# EAGLE design module_ram (EAGLE 5.09)
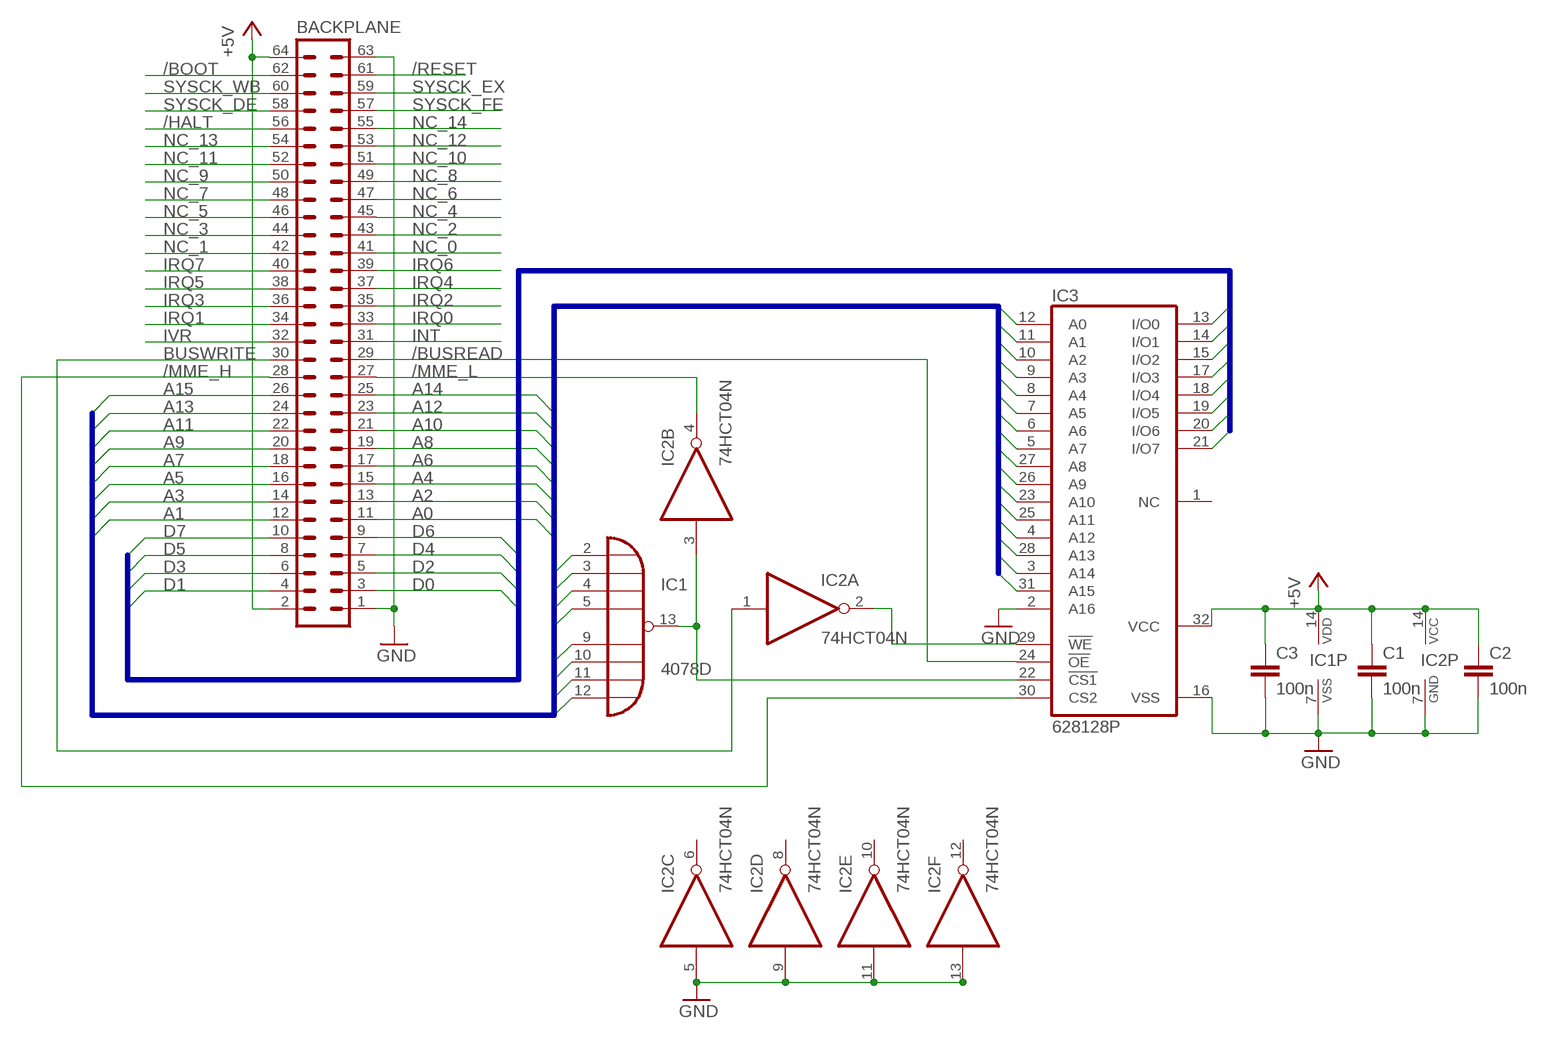
[diagram p0: schematic, sheet 1]

## Parts
BACKPLANE  ML64L  [ML64L]
C1  100n  C-EU025-024X044  [C025-024X044]
C2  100n  C-EU025-024X044  [C025-024X044]
C3  100n  C-EUC0805  [C0805]
IC1  4078D  [SO14]
IC2  74HCT04N  [DIL14]
IC3  628128P  [DIL32]

## Nets
+5V: BACKPLANE.2 BACKPLANE.64 C1.1 C2.1 C3.1 IC1.14(VDD) IC2.14(P:VCC) IC3.32(VCC)
/BOOT: BACKPLANE.62
/BUSREAD: BACKPLANE.29 IC3.24(!OE)
/HALT: BACKPLANE.56
/MME_H: BACKPLANE.28 IC3.30(CS2)
/MME_L: BACKPLANE.27 IC2.4(B:O)
/RESET: BACKPLANE.61
A0: BACKPLANE.11 IC1.2(I0) IC3.12(A0)
A1: BACKPLANE.12 IC1.3(I1) IC3.11(A1)
A2: BACKPLANE.13 IC1.4(I2) IC3.10(A2)
A3: BACKPLANE.14 IC1.5(I3) IC3.9(A3)
A4: BACKPLANE.15 IC1.9(I4) IC3.8(A4)
A5: BACKPLANE.16 IC1.10(I5) IC3.7(A5)
A6: BACKPLANE.17 IC1.11(I6) IC3.6(A6)
A7: BACKPLANE.18 IC1.12(I7) IC3.5(A7)
A8: BACKPLANE.19 IC3.27(A8)
A9: BACKPLANE.20 IC3.26(A9)
A10: BACKPLANE.21 IC3.23(A10)
A11: BACKPLANE.22 IC3.25(A11)
A12: BACKPLANE.23 IC3.4(A12)
A13: BACKPLANE.24 IC3.28(A13)
A14: BACKPLANE.25 IC3.3(A14)
A15: BACKPLANE.26 IC3.31(A15)
BUSWRITE: BACKPLANE.30 IC2.1(A:I)
D0: BACKPLANE.3 IC3.13(I/O0)
D1: BACKPLANE.4 IC3.14(I/O1)
D2: BACKPLANE.5 IC3.15(I/O2)
D3: BACKPLANE.6 IC3.17(I/O3)
D4: BACKPLANE.7 IC3.18(I/O4)
D5: BACKPLANE.8 IC3.19(I/O5)
D6: BACKPLANE.9 IC3.20(I/O6)
D7: BACKPLANE.10 IC3.21(I/O7)
GND: BACKPLANE.1 BACKPLANE.63 C1.2 C2.2 C3.2 IC1.7(VSS) IC2.5(C:I) IC2.7(P:GND) IC2.9(D:I) IC2.11(E:I) IC2.13(F:I) IC3.2(A16) IC3.16(VSS)
INT: BACKPLANE.31
IRQ0: BACKPLANE.33
IRQ1: BACKPLANE.34
IRQ2: BACKPLANE.35
IRQ3: BACKPLANE.36
IRQ4: BACKPLANE.37
IRQ5: BACKPLANE.38
IRQ6: BACKPLANE.39
IRQ7: BACKPLANE.40
IVR: BACKPLANE.32
N$1: IC2.2(A:O) IC3.29(!WE)
N$2: IC1.13(J) IC2.3(B:I) IC3.22(!CS1)
NC_0: BACKPLANE.41
NC_1: BACKPLANE.42
NC_2: BACKPLANE.43
NC_3: BACKPLANE.44
NC_4: BACKPLANE.45
NC_5: BACKPLANE.46
NC_6: BACKPLANE.47
NC_7: BACKPLANE.48
NC_8: BACKPLANE.49
NC_9: BACKPLANE.50
NC_10: BACKPLANE.51
NC_11: BACKPLANE.52
NC_12: BACKPLANE.53
NC_13: BACKPLANE.54
NC_14: BACKPLANE.55
SYSCK_DE: BACKPLANE.58
SYSCK_EX: BACKPLANE.59
SYSCK_FE: BACKPLANE.57
SYSCK_WB: BACKPLANE.60
Unconnected: IC2.6(C:O) IC2.8(D:O) IC2.10(E:O) IC2.12(F:O) IC3.1(NC)

## Buses
D[0..7]
A[0..15]

## Library data of the parts
BACKPLANE = con-ml:ML64L: HARTING
C1-C3 = rcl:C-EU: CAPACITOR, European symbol
IC1 = 40xx:4078: 8-input NOR
IC2 = 74xx-eu:74*04: Hex INVERTER
IC3 = memory-hitachi:628128P: MEMORY

## Net classes
0 Signal: width 0.254 mm, drill 0.508 mm, clearance 0.203 mm
1 LoVolt42: width 0.61 mm, drill 0.508 mm, clearance 0.813 mm to class 0, clearance 0.305 mm
2 MedVolt100: width 0.61 mm, drill 0.508 mm, clearance 1.626 mm to class 0, clearance 1.626 mm to class 1, clearance 0.813 mm
3 LineVolt350: width 0.813 mm, drill 0.508 mm, clearance 12.7 mm to class 0, clearance 12.7 mm to class 1, clearance 12.7 mm to class 2, clearance 2.54 mm

## Board
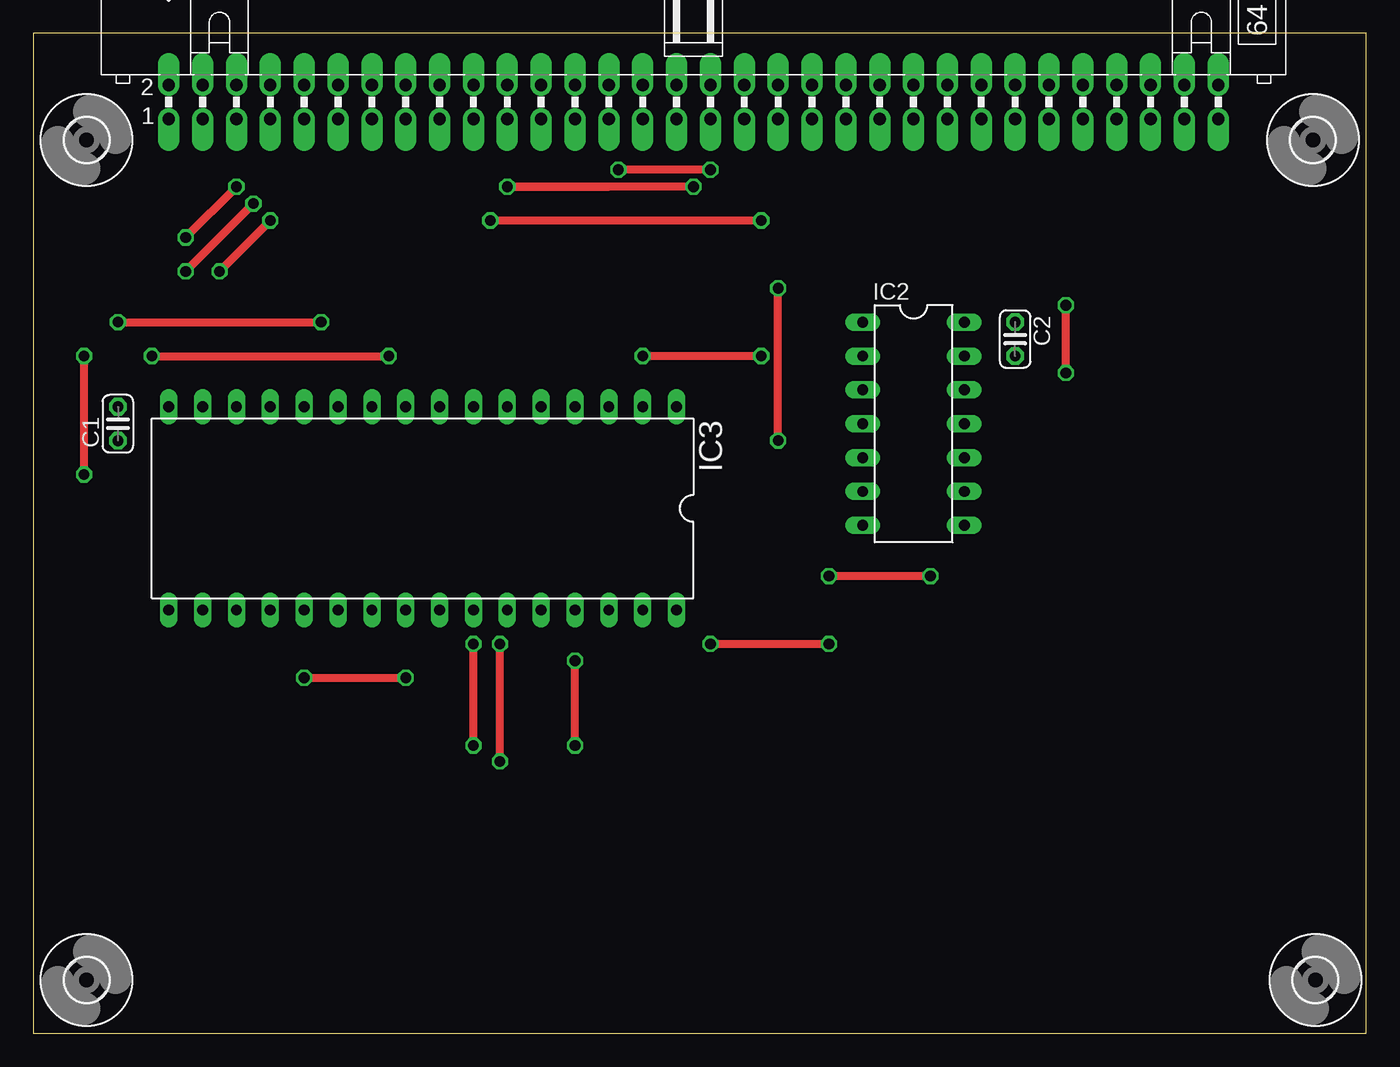
[diagram p1: board, top side]
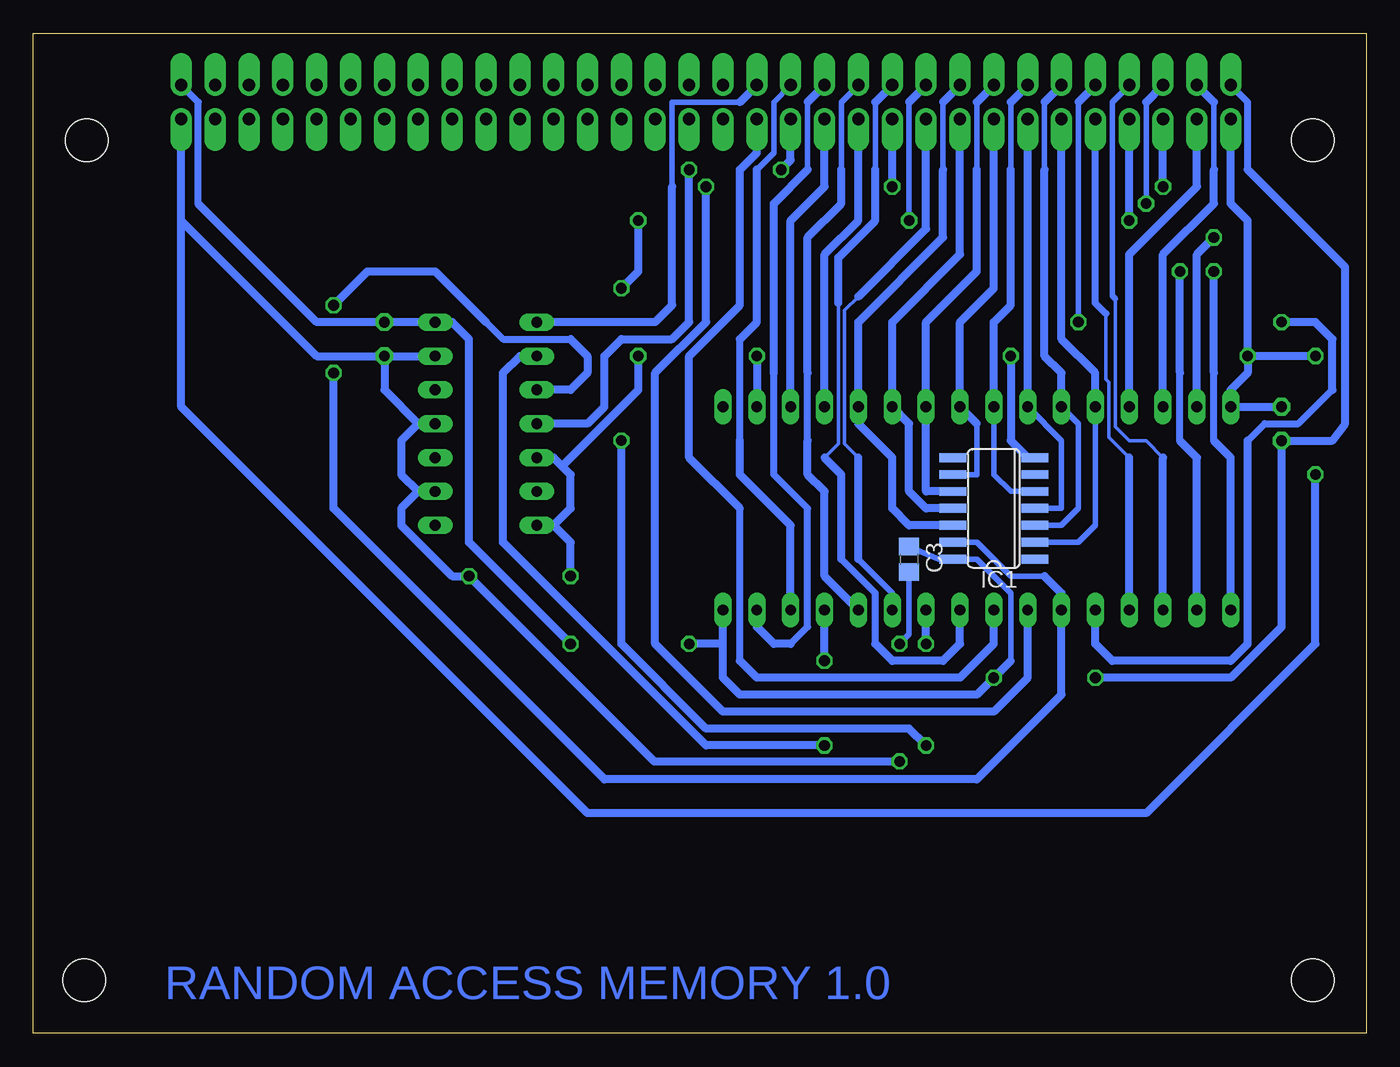
[diagram p2: board, bottom side, seen from below]

Size 100 x 75 mm. Coordinates in mm from the lower left corner, seen from the top.
Outline: 0,0 100,0 100,75 0,75 0,0
Copper layers (1*16): Top 0.035mm / dielectric 1.5mm / Bottom 0.035mm
Design rules "designrules": minimum track width 10mil, minimum drill 24mil, track to track 8mil, track to pad 8mil, pad to pad 8mil, via to via 8mil, smd to smd 8mil, copper to edge 40mil, drill to drill 8mil, minimum pad ring 10mil, minimum via ring 8mil, stop-mask expansion 4mil, vias tented up to drill 0mil, thermal gap 10mil

### Footprints (pad centres in the part's own frame; a part is rotated, then mirrored left to right if it is on the bottom)
ML64L = drill 0.914 pad 1.6 offset: 1 -39.37,-1.27; 2 -39.37,1.27; 3 -36.83,-1.27; 4 -36.83,1.27; 5 -34.29,-1.27; 6 -34.29,1.27; 7 -31.75,-1.27; 8 -31.75,1.27; 9 -29.21,-1.27; 10 -29.21,1.27; 11 -26.67,-1.27; 12 -26.67,1.27; 13 -24.13,-1.27; 14 -24.13,1.27; 15 -21.59,-1.27; 16 -21.59,1.27; 17 -19.05,-1.27; 18 -19.05,1.27; 19 -16.51,-1.27; 20 -16.51,1.27; 21 -13.97,-1.27; 22 -13.97,1.27; 23 -11.43,-1.27; 24 -11.43,1.27; 25 -8.89,-1.27; 26 -8.89,1.27; 27 -6.35,-1.27; 28 -6.35,1.27; 29 -3.81,-1.27; 30 -3.81,1.27; 31 -1.27,-1.27; 32 -1.27,1.27; 33 1.27,-1.27; 34 1.27,1.27; 35 3.81,-1.27; 36 3.81,1.27; 37 6.35,-1.27; 38 6.35,1.27; 39 8.89,-1.27; 40 8.89,1.27; 41 11.43,-1.27; 42 11.43,1.27; 43 13.97,-1.27; 44 13.97,1.27; 45 16.51,-1.27; 46 16.51,1.27; 47 19.05,-1.27; 48 19.05,1.27; 49 21.59,-1.27; 50 21.59,1.27; 51 24.13,-1.27; 52 24.13,1.27; 53 26.67,-1.27; 54 26.67,1.27; 55 29.21,-1.27; 56 29.21,1.27; 57 31.75,-1.27; 58 31.75,1.27; 59 34.29,-1.27; 60 34.29,1.27; 61 36.83,-1.27; 62 36.83,1.27; 63 39.37,-1.27; 64 39.37,1.27
C025-024X044 = drill 0.813 octagon: 1 -1.27,0; 2 1.27,0
C0805 = smd 1.3 x 1.5: 1 -0.95,0; 2 0.95,0
SO14 = smd 0.66 x 2.032: 1 -3.81,-3.073; 2 -2.54,-3.073; 3 -1.27,-3.073; 4 0,-3.073; 5 1.27,-3.073; 6 2.54,-3.073; 7 3.81,-3.073; 8 3.81,3.073; 9 2.54,3.073; 10 1.27,3.073; 11 0,3.073; 12 -1.27,3.073; 13 -2.54,3.073; 14 -3.81,3.073
DIL14 = drill 0.813 long: 1 -7.62,-3.81; 2 -5.08,-3.81; 3 -2.54,-3.81; 4 0,-3.81; 5 2.54,-3.81; 6 5.08,-3.81; 7 7.62,-3.81; 8 7.62,3.81; 9 5.08,3.81; 10 2.54,3.81; 11 0,3.81; 12 -2.54,3.81; 13 -5.08,3.81; 14 -7.62,3.81
DIL32 = drill 0.813 long: 1 -19.05,-7.62; 2 -16.51,-7.62; 3 -13.97,-7.62; 4 -11.43,-7.62; 5 -8.89,-7.62; 6 -6.35,-7.62; 7 -3.81,-7.62; 8 -1.27,-7.62; 9 1.27,-7.62; 10 3.81,-7.62; 11 6.35,-7.62; 12 8.89,-7.62; 13 11.43,-7.62; 14 13.97,-7.62; 15 16.51,-7.62; 16 19.05,-7.62; 17 19.05,7.62; 18 16.51,7.62; 19 13.97,7.62; 20 11.43,7.62; 21 8.89,7.62; 22 6.35,7.62; 23 3.81,7.62; 24 1.27,7.62; 25 -1.27,7.62; 26 -3.81,7.62; 27 -6.35,7.62; 28 -8.89,7.62; 29 -11.43,7.62; 30 -13.97,7.62; 31 -16.51,7.62; 32 -19.05,7.62
3,2 = hole 3.2: 0,0

### Placement (x,y rotation side)
BACKPLANE  49.53,69.85 0 top
C1  6.35,45.72 90 top
C2  73.66,52.07 270 top
C3  34.29,35.56 270 bottom
IC1  27.94,39.37 90 bottom
IC2  66.04,45.72 270 top
IC3  29.21,39.37 180 top
U$1  [3,2]  4,4 0 top
U$2  [3,2]  4,67 0 top
U$3  [3,2]  96,67 0 top
U$4  [3,2]  96.19,4 0 top

### Tracks (layer width: path | path; a pad name or v marks a point on that pad's centre or on a via)
+5V  (via drill 0.8 pad 1.02)
  Top 0.61: v50.8,29.21 v59.69,29.21 | v20.32,26.67 v27.94,26.67
  Bottom 0.406: 26.67,27.94 26.67,33.02 29.21,35.56 IC1.14 31.75,35.56 32.06,35.56 C3.1
  Bottom 0.508: BACKPLANE.2 8.89,69.85 8.89,64.77 | 87.63,62.23 87.63,69.85 BACKPLANE.64
  Bottom 0.61: 48.26,29.21 48.26,26.67 46.99,25.4 29.21,25.4 v27.94,26.67 26.67,27.94 | 48.26,29.21 IC3.32 | v59.69,29.21 67.31,36.83 67.31,52.07 68.58,53.34 IC2.14 C2.1 78.74,53.34 87.63,62.23 | 48.26,29.21 v50.8,29.21 | 8.89,64.77 1.59,57.47 1.59,45.72 2.54,44.45 C1.1 6.35,30.48 10.16,26.67 v20.32,26.67
/BUSREAD
  Bottom 0.508: 46.99,27.94 46.99,39.37
  Bottom 0.61: IC3.24 27.94,29.21 30.48,26.67 45.72,26.67 46.99,27.94 | 46.99,39.37 50.8,43.18 50.8,50.8 46.99,54.61 46.99,64.77 45.72,66.04 BACKPLANE.29
/MME_H
  Bottom 0.406: 45.72,64.77 44.45,66.04 44.45,69.85 BACKPLANE.28
  Bottom 0.508: 46.99,44.45 46.99,52.07
  Bottom 0.61: IC3.30 43.18,38.1 46.99,41.91 46.99,44.45 | 46.99,52.07 45.72,53.34 45.72,64.77
/MME_L  (via drill 0.8 pad 1.02)
  Top 0.61: v50.8,64.77 v43.89,64.77
  Bottom 0.61: BACKPLANE.27 43.18,65.48 v43.89,64.77 | v50.8,64.77 50.8,53.34 52.07,52.07 55.88,52.07 57.15,50.8 57.15,46.99 58.42,45.72 IC2.4
A0
  Bottom 0.406: IC1.2 21.59,36.83 20.32,38.1 IC3.12
  Bottom 0.61: BACKPLANE.11 22.86,52.07 20.32,49.53 IC3.12
A1
  Bottom 0.406: 24.13,64.77 24.13,69.85 | IC1.3 22.86,38.1 21.59,39.37 21.59,45.72 IC3.11
  Bottom 0.61: IC3.11 22.86,49.53 24.13,50.8 24.13,64.77 | 24.13,69.85 BACKPLANE.12
A2
  Bottom 0.406: IC1.4 22.86,39.37 22.86,44.45 IC3.10
  Bottom 0.61: IC3.10 BACKPLANE.13
A3
  Bottom 0.406: 26.67,64.77 26.67,69.85 | IC1.5 26.67,40.64 27.94,41.91 IC3.9
  Bottom 0.61: IC3.9 27.94,53.34 26.67,54.61 26.67,64.77 | 26.67,69.85 BACKPLANE.14
A4
  Bottom 0.406: IC1.9 29.21,41.91 29.21,45.72
  Bottom 0.61: BACKPLANE.15 27.94,55.88 30.48,53.34 IC3.8 29.21,45.72
A5
  Bottom 0.406: 29.21,64.77 29.21,69.85
  Bottom 0.61: 29.21,69.85 BACKPLANE.16 | 29.21,64.77 29.21,57.15 33.02,53.34 IC3.7 33.02,40.64 IC1.10
A6
  Bottom 0.61: BACKPLANE.17 30.48,58.42 35.56,53.34 IC3.6 34.29,45.72 34.29,40.64 33.02,39.37 IC1.11
A7
  Bottom 0.406: 31.75,64.77 31.75,69.85
  Bottom 0.61: 31.75,69.85 BACKPLANE.18 | 31.75,64.77 31.75,59.69 38.1,53.34 IC3.5 38.1,45.72 35.56,43.18 35.56,39.37 34.29,38.1 IC1.12
A8
  Bottom 0.254: 38.1,55.24 39.13,54.21 39.13,44.21 38.1,43.18
  Bottom 0.406: IC3.27 35.56,33.02 38.1,35.56
  Bottom 0.61: BACKPLANE.19 33.02,60.33 38.1,55.24 | 38.1,35.56 38.1,43.18
A9  (via drill 0.8 pad 1.02)
  Top 0.61: v54.61,60.96 v34.29,60.96 | v55.88,44.45 v55.88,55.88 | v33.02,21.59 v33.02,29.21
  Bottom 0.406: v34.29,60.96 34.29,69.85
  Bottom 0.61: 34.29,69.85 BACKPLANE.20 | v54.61,60.96 54.61,57.15 v55.88,55.88 | v55.88,44.45 55.88,29.21 49.53,22.86 34.29,22.86 v33.02,21.59 | v33.02,29.21 IC3.26
A10  (via drill 0.8 pad 0.61, 0.8 pad 1.02)
  Top 0.61: 43.18,63.5 v35.56,63.5 v49.53,63.5
  Bottom 0.61: v35.56,63.5 BACKPLANE.21 | v49.53,63.5 49.53,53.34 53.34,49.53 53.34,29.21 48.26,24.13 27.94,24.13 25.4,26.67 IC3.23
A11
  Bottom 0.254: 40.64,43.18 39.61,44.21 39.61,54.77
  Bottom 0.406: 36.83,64.77 36.83,69.85
  Bottom 0.508: 36.83,29.21 36.83,33.02 39.37,35.56
  Bottom 0.61: 36.83,69.85 BACKPLANE.22 | 36.83,64.77 36.83,60.96 39.61,58.18 39.61,54.77 | 40.64,43.18 39.37,41.91 39.37,35.56 | 36.83,29.21 35.56,27.94 31.75,27.94 30.48,29.21 IC3.25
A12
  Bottom 0.61: IC3.4 40.64,58.42 38.1,60.96 BACKPLANE.23
A13
  Bottom 0.406: 39.37,64.77 39.37,69.85 BACKPLANE.24
  Bottom 0.508: 41.91,44.45 41.91,49.53
  Bottom 0.61: IC3.28 40.64,34.29 40.64,40.64 41.91,41.91 41.91,44.45 | 41.91,49.53 41.91,59.69 39.37,62.23 39.37,64.77
A14
  Bottom 0.61: BACKPLANE.25 40.64,63.5 43.18,60.96 IC3.3
A15
  Bottom 0.406: 41.91,64.77 41.91,69.85
  Bottom 0.508: 43.18,29.21 41.91,30.48 41.91,39.37 44.45,41.91 44.45,49.53
  Bottom 0.61: 41.91,69.85 BACKPLANE.26 | 41.91,64.77 44.45,62.23 44.45,49.53 | IC3.31 45.72,30.48 44.45,29.21 43.18,29.21
BUSWRITE
  Bottom 0.406: 46.99,69.85 52.07,69.85 52.07,63.5
  Bottom 0.61: 46.99,69.85 BACKPLANE.30 | 52.07,63.5 52.07,54.61 53.34,53.34 IC2.1
D0
  Bottom 0.61: BACKPLANE.3 12.7,63.5 17.78,58.42 IC3.13
D1
  Bottom 0.406: 11.43,64.77 11.43,69.85
  Bottom 0.61: IC3.14 15.24,58.42 11.43,62.23 11.43,64.77 | 11.43,69.85 BACKPLANE.4
D2  (via drill 0.8 pad 1.02)
  Top 0.61: v11.43,59.69 v15.24,63.5
  Bottom 0.61: IC3.15 12.7,58.42 v11.43,59.69 | v15.24,63.5 BACKPLANE.5
D3  (via drill 0.8 pad 1.02)
  Top 0.61: v11.43,57.15 v16.51,62.23
  Bottom 0.406: v16.51,62.23 16.51,69.85
  Bottom 0.508: 11.43,44.45 11.43,49.53
  Bottom 0.61: 16.51,69.85 BACKPLANE.6 | 11.43,49.53 v11.43,57.15 | 11.43,44.45 10.16,43.18 IC3.17
D4  (via drill 0.8 pad 1.02)
  Top 0.61: v13.97,57.15 v17.78,60.96
  Bottom 0.508: 13.97,44.45 13.97,49.53
  Bottom 0.61: v17.78,60.96 BACKPLANE.7 | 13.97,49.53 v13.97,57.15 | 13.97,44.45 12.7,43.18 IC3.18
D5
  Bottom 0.254: 15.24,43.18 16.51,44.45 17.78,44.45 18.81,45.48 18.81,55.09
  Bottom 0.406: 18.81,55.09 19.05,55.32 19.05,69.85 BACKPLANE.8
  Bottom 0.61: IC3.19 15.24,43.18
D6
  Bottom 0.254: 17.78,43.18 19.29,44.69 19.29,48.82 19.53,49.05 19.53,53.98
  Bottom 0.508: 19.53,53.98 20.32,54.77 BACKPLANE.9
  Bottom 0.61: IC3.20 17.78,43.18
D7  (via drill 0.8 pad 1.02)
  Top 0.61: v6.35,53.34 v21.59,53.34
  Bottom 0.406: v21.59,53.34 21.59,69.85
  Bottom 0.508: 2.54,48.26 5.08,45.72 7.62,45.72 8.89,44.45
  Bottom 0.61: 21.59,69.85 BACKPLANE.10 | v6.35,53.34 3.81,53.34 2.54,52.07 2.54,48.26 | 8.89,44.45 8.89,29.21 10.16,27.94 19.05,27.94 20.32,29.21 IC3.21
GND  (via drill 0.8 pad 1.02)
  Top 0.61: v67.31,34.29 v59.69,34.29 | v8.89,50.8 v26.67,50.8 | v54.61,50.8 v45.72,50.8 | v35,20.4 v35,29.21 | v3.81,41.91 v3.81,50.8
  Bottom 0.406: C3.2 34.29,29.92 v35,29.21
  Bottom 0.61: IC2.5 60.96,43.18 60.33,42.55 | 60.33,42.55 59.69,41.91 59.69,39.37 60.96,38.1 | 60.96,38.1 IC2.7 | C2.2 IC2.13 | C2.2 78.74,50.8 88.9,60.96 | 71.12,45.72 72.39,44.45 72.39,41.91 71.12,40.64 | 71.12,40.64 IC2.9 | 71.12,45.72 IC2.11 | 71.12,45.72 73.66,48.26 C2.2 | 71.12,40.64 72.39,39.37 72.39,38.1 68.58,34.29 v67.31,34.29 53.42,20.4 v35,20.4 | v59.69,34.29 59.69,36.83 60.96,38.1 | IC1.7 25.4,43.18 26.67,44.45 v26.67,50.8 | v8.89,50.8 8.89,49.53 10.16,48.26 IC3.16 C1.2 | v8.89,50.8 8.89,60.96 10.16,62.23 BACKPLANE.1 | v45.72,50.8 IC3.2 | v54.61,50.8 54.61,48.26 60.33,42.55 | 88.9,60.96 88.9,46.99 58.42,16.51 16.51,16.51 3.81,29.21 v3.81,41.91 | 88.9,60.96 BACKPLANE.63 | v3.81,50.8 v8.89,50.8
N$1  (via drill 0.8 pad 1.02)
  Top 0.61: v40.64,21.59 v40.64,27.94
  Bottom 0.61: IC2.2 63.5,50.8 64.77,49.53 64.77,36.83 49.53,21.59 v40.64,21.59 | v40.64,27.94 IC3.29
N$2  (via drill 0.8 pad 1.02)
  Top 0.61: v77.47,49.53 v77.47,54.61
  Bottom 0.406: IC1.13 29.21,36.83 26.67,34.29 24.13,34.29
  Bottom 0.508: 59.69,52.07 64.77,52.07 66.04,53.34
  Bottom 0.61: 24.13,34.29 22.86,33.02 IC3.22 22.86,25.4 29.21,19.05 57.15,19.05 77.47,39.37 v77.47,49.53 | IC2.3 59.69,48.26 58.42,49.53 58.42,50.8 59.69,52.07 | 66.04,53.34 69.85,57.15 74.93,57.15 v77.47,54.61

### Text on the board
Bottom: RANDOM ACCESS MEMORY 1.0